# EAGLE schematic tip41c-li-iron-charger-v0 (EAGLE 5.07)
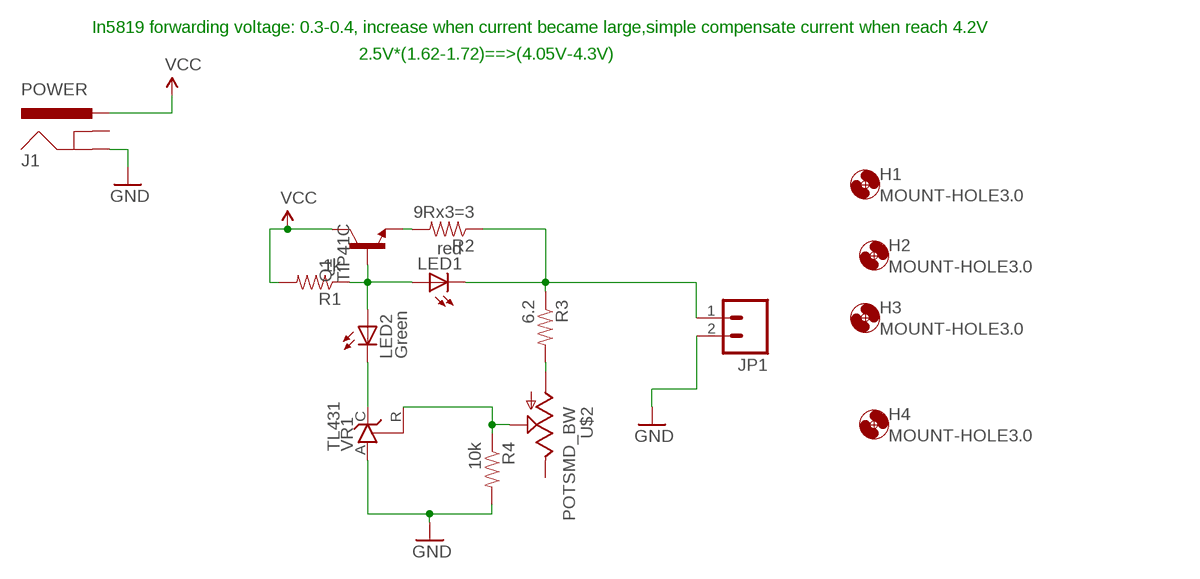
[diagram p0: schematic, sheet 1]

## Parts
H1  MOUNT-HOLE3.0  [3,0]
H2  MOUNT-HOLE3.0  [3,0]
H3  MOUNT-HOLE3.0  [3,0]
H4  MOUNT-HOLE3.0  [3,0]
J1  POWER  POWER_JACKPTH_BIG  [POWER_JACK_2.1X5.5_BIG_PTH]
JP1  M02LOCK_LONGPADS  [1X02_LOCK_LONGPADS]
LED1  red  LED-RF  [LED-RF]
LED2  Green  LED-RF  [LED-RF]
Q1  TIP41C  -NPN-TO220-RF  [TO220-RF]
R1  1k  RESISTOR1/4W-RF  [AXIAL-0.3-SMD]
R2  9Rx3=3  RESISTOR1/4W-RF  [AXIAL-0.3-SMD]
R3  6.2  RESISTOR1/4W-RF  [AXIAL-0.3-SMD]
R4  10k  RESISTOR1/4W-RF  [AXIAL-0.3-SMD]
U$2  POTSMD_BW  [POT_SMD_BLUE_WHITE]
VR1  TL431  TL431RAC-RF  [TO92-RAC-RF]

## Nets
GND: J1.GND JP1.2 R4.P$2 VR1.A
N$1: Q1.3(E) R2.P$2
N$2: LED2.K(C) VR1.C
N$3: LED1.A LED2.A Q1.1(B) R1.P$1
N$4: JP1.1 LED1.K(C) R2.P$1 R3.P$1
N$5: R4.P$1 U$2.S VR1.R
N$6: R3.P$2 U$2.A
VCC: J1.PWR Q1.2(C) R1.P$2
Unconnected: J1.GNDBREAK U$2.E

## Notes on the sheet
- In5819 forwarding voltage: 0.3-0.4, increase when current became large,simple compensate current when reach 4.2V
- 2.5V*(1.62-1.72)==>(4.05V-4.3V)

## Library data of the parts
H1-H4 = holes:MOUNT-HOLE: MOUNTING HOLE with drill center marker
J1 = digital-toy:POWER_JACK: Power Jack This is the standard 5.5mm barrel jack for power. The PTH is the most common, proven, reliable, footprint. All others are experimental. The Slot footprint only works if the mill layer is transmitted to the PCB fab house so be warned. Spark Fun Electronics SKU : PRT-00119. Mating wall wart : TOL-00298 (and others)
JP1 = SparkFun:M02: Header 2 Standard 2-pin 0.1" header. Use with straight break away headers (SKU : PRT-00116), right angle break away headers (PRT-00553), swiss pins (PRT-00743), machine pins (PRT-00117), and female headers (PRT-00115). Molex polarized connector foot print use with SKU : PRT-08233 with associated crimp pins and housings.
LED1 LED2 = digital-toy:LED: LEDs Standard schematic elements and footprints for 5mm, 3mm, 1206, and 0603 sized LEDs. 5mm - Spark Fun Electronics SKU : COM-00529 (and others) copy led.lbr 0805 led here, by hyl digital-toy. 2010.6.29
Q1 = digital-toy:*-NPN-: NPN Transistror most of sot-23 use the pacages sot23-BEC, top C, left B, right E. by hyl, digital-toy. and to-92 use ebc(from-top) by hyl, digital-toy.
R1-R4 = digital-toy:RESISTOR: Resistor Basic schematic elements and footprints for 0603, 1206, and PTH 1/10th watt (small) resistors. digital-toy copy vertical mount of axial-0.3 from rcl.lbr : the 0207/xx
U$2 = digital-toy:POT: POT digital toy POT, 3296 multi turn, blue-white ... hyl 8/07/2001
VR1 = digital-toy:TL431: VOLTAGE REGULATOR